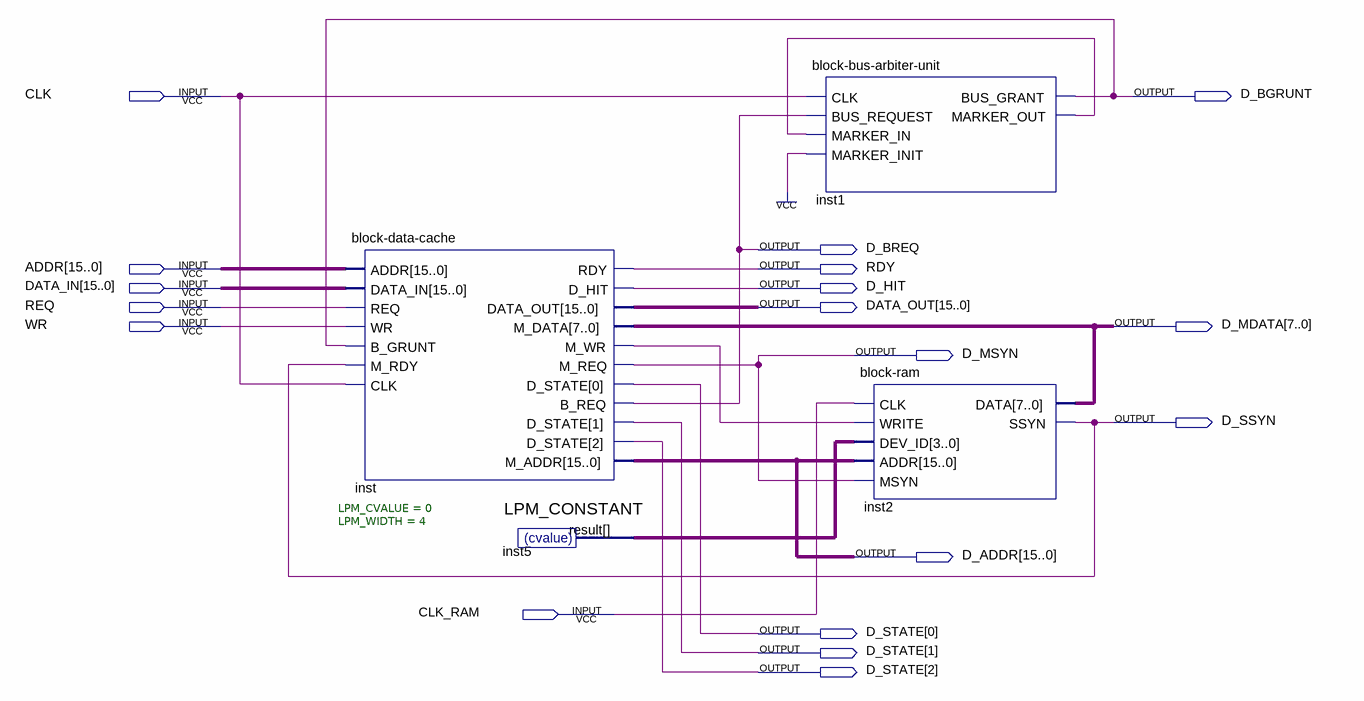
[diagram p0: schematic sheet]
// Quartus schematic test-block-data-cache.bdf as structural Verilog: 4 symbols, 18 pins
module \test-block-data-cache  (
  input  CLK,
  input  [15:0] ADDR,
  input  [15:0] DATA_IN,
  input  REQ,
  input  WR,
  input  CLK_RAM,
  output D_BGRUNT,
  output D_BREQ,
  output RDY,
  output D_HIT,
  output [15:0] DATA_OUT,
  output [7:0] D_MDATA,
  output D_MSYN,
  output D_SSYN,
  output [15:0] D_ADDR,
  output [2:0] D_STATE
);

  wire inst1_marker_out, inst_m_wr;
  wire [3:0] inst5_result;

  \block-data-cache  inst (
    .ADDR(ADDR), .DATA_IN(DATA_IN), .REQ(REQ), .WR(WR), .B_GRUNT(D_BGRUNT), .M_RDY(D_SSYN), .CLK(CLK),
    .RDY(RDY), .D_HIT(D_HIT), .DATA_OUT(DATA_OUT), .M_WR(inst_m_wr), .M_REQ(D_MSYN), .D_STATE(D_STATE),
    .B_REQ(D_BREQ), .M_ADDR(D_ADDR), .M_DATA(D_MDATA));
  LPM_CONSTANT #(.LPM_CVALUE(0), .LPM_WIDTH(4)) inst5 (.result(inst5_result));
  \block-bus-arbiter-unit  inst1 (
    .CLK(CLK), .BUS_REQUEST(D_BREQ), .MARKER_IN(inst1_marker_out), .MARKER_INIT(1'b1), .BUS_GRANT(D_BGRUNT),
    .MARKER_OUT(inst1_marker_out));
  \block-ram  inst2 (
    .CLK(CLK_RAM), .WRITE(inst_m_wr), .DEV_ID(inst5_result), .ADDR(D_ADDR), .MSYN(D_MSYN), .SSYN(D_SSYN),
    .DATA(D_MDATA));
endmodule
